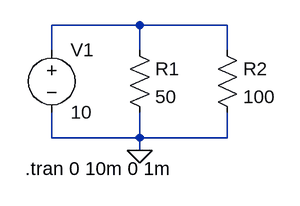
[diagram p0: schematic Exp1.asc]
Exp1.asc, the LTspice schematic file:
Version 4
SHEET 1 880 680
WIRE 176 48 64 48
WIRE 288 48 176 48
WIRE 64 80 64 48
WIRE 176 80 176 48
WIRE 288 80 288 48
WIRE 64 192 64 160
WIRE 176 192 176 160
WIRE 176 192 64 192
WIRE 288 192 288 160
WIRE 288 192 176 192
WIRE 176 208 176 192
FLAG 176 208 0
SYMBOL res 160 64 R0
SYMATTR InstName R1
SYMATTR Value 50
SYMBOL res 272 64 R0
SYMATTR InstName R2
SYMATTR Value 100
SYMBOL voltage 64 64 R0
WINDOW 123 0 0 Left 0
WINDOW 39 0 0 Left 0
SYMATTR InstName V1
SYMATTR Value 10
TEXT 30 232 Left 2 !.tran 0 10m 0 1m

The netlist it stands for:
* Exp1.asc
R1 N001 0 50
R2 N001 0 100
V1 N001 0 10
.tran 0 10m 0 1m
.backanno
.end